# Altium schematic sheet ESP8285.SchDoc
size A; SheetNumber: 1
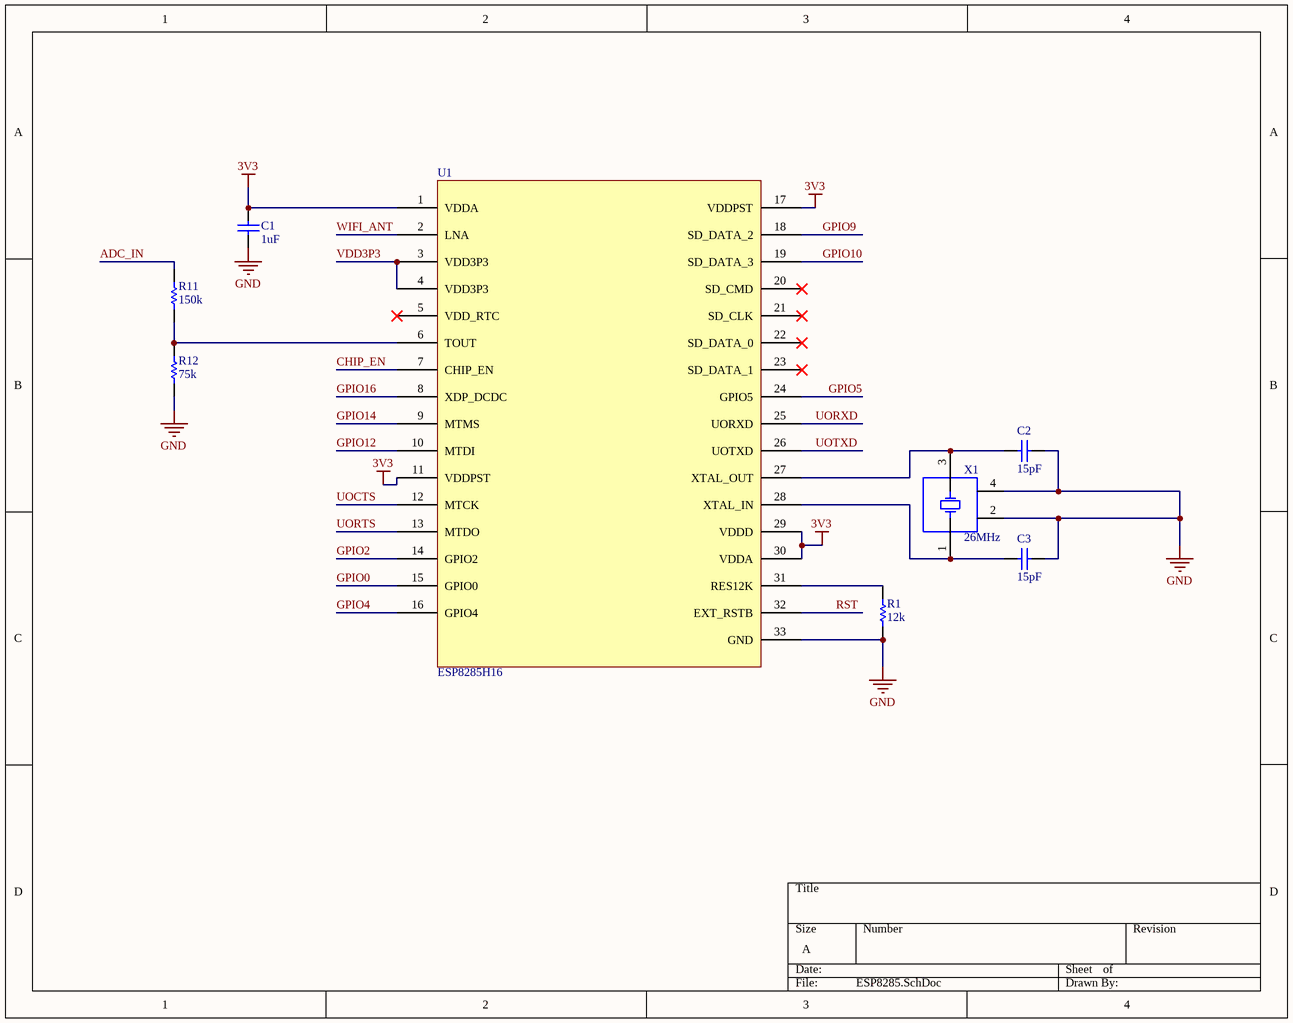
[diagram p0: ESP8285.SchDoc]

## Parts
C1  1uF  [C0805]
C2  15pF  [PCB-98fz84kwkqgd8opjlb99-1]
C3  15pF  [PCB-98fz84kwkqgd8opjlb99-1]
R1  12k  [RESC1609X50X30LL10T20]
R11  150k  [RESC1608X55X30LL15T15]
R12  75k  [RESC1608X55X30LL15T15]
U1  ESP8285H16  [PCB-1fh2hqe1x48mh17li7t6-1]
X1  26MHz  [PCB-1zhjv6m1p58g6yr6i7sc-1]

## Nets
3V3: C1.1 U1.1(VDDA) U1.11(VDDPST) U1.17(VDDPST) U1.29(VDDD) U1.30(VDDA)
GND: C1.2 C2.2 C3.2 R1.1 R12.1 U1.33(GND) X1.2 X1.4
ADC_IN: R11.2
CHIP_EN: U1.7(CHIP_EN)
GPIO0: U1.15(GPIO0)
GPIO2: U1.14(GPIO2)
GPIO4: U1.16(GPIO4)
GPIO5: U1.24(GPIO5)
GPIO9: U1.18(SD_DATA_2)
GPIO10: U1.19(SD_DATA_3)
GPIO12: U1.10(MTDI)
GPIO14: U1.9(MTMS)
GPIO16: U1.8(XDP_DCDC)
RST: U1.32(EXT_RSTB)
UOCTS: U1.12(MTCK)
UORTS: U1.13(MTDO)
UORXD: U1.25(UORXD)
UOTXD: U1.26(UOTXD)
VDD3P3: U1.3(VDD3P3) U1.4(VDD3P3)
WIFI_ANT: U1.2(LNA)
NetC2_1: C2.1 U1.27(XTAL_OUT) X1.3
NetC3_1: C3.1 U1.28(XTAL_IN) X1.1
NetR1_2: R1.2 U1.31(RES12K)
NetR11_1: R11.1 R12.2 U1.6(TOUT)

Not connected (* = marked no-connect by the designer): U1 5(VDD_RTC)* 20(SD_CMD)* 21(SD_CLK)* 22(SD_DATA_0)* 23(SD_DATA_1)*

## Library data of the parts
C1 = CMP-77c3bc4dc880a804-3: 0805 1 uF 25 V ±10 % Tolerance X7R SMT Multilayer Ceramic Capacitor; Manufacturer Part Number: CC0805KKX7R8BB105; Lead-Free Status: Lead Free; Voltage Rating (DC): 25.0 V; Capacitance Tolerance: ±10%; Octopart Url: http://octopart.com/cc0805kkx7r8bb105-yageo-42244645; Seller Landing  Url: https://octopart-clicks.com/click/track?country=US&ak=8157f166&sig=04b9cde&sid=5489&ppid=42244645&vpid=127579773&ct=offers; Number of Pins: 2; Mounting Style: Surface Mount; Packaging: Cut Tape (CT); Case/Package: 0805; REACH SVHC Compliance: No SVHC; RoHS: Compliant; Halogen Free Status: Halogen Free; Capacitance: 1uF; OctopartID: 77c3bc4dc880a804; Dielectric Characteristic: X7R
C2 C3 = CMP-a0ab688c22207f6c-1: 15pF ±1% 50V C0G, NP0 Ceramic Capacitor -55°C ~ 125°C Surface Mount, MLCC 0402 (1005 Metric) 0.039" L x 0.020" W (1.00mm x 0.50mm); Manufacturer Part Number: GRM1555C1H150FA01D; Manufacturer: Murata Electronics North America; Vendor Part Number: 490-6200-1-ND; Manufacturer Part Number, Other: 490-6200-1; Category: Capacitors; Family: Digikey; Capacitance: 15pF; Cost: Ceramic Capacitors; Tolerance: ±1%; Thickness (Max): 0.022" (0.55mm); Octopart URL: http://octopart.com/grm1555c1h150fa01d-murata-19769325; OctopartID: a0ab688c22207f6c; Operating Temperature: -55°C ~ 125°C; Size / Dimension: 0.039" L x 0.020" W (1.00mm x 0.50mm); Temperature Coefficien: C0G, NP0; Mounting Type: Surface Mount, MLCC; Applications: General Purpose; Package / Case: 0402 (1005 Metric); Voltage - Rated: 50V
R1 = CMP-1857522-10: Res Thick Film 0603 12K Ohm 1% 0.1W(1/10W) ±100ppm/C Molded SMD Automotive Paper T/R
R11 = CMP-3654711-2: Thick Film Resistors - SMD 0603 150Kohms 1% Tol; Manufacturer Part Number: ERJ-3EKF1503V; Lead-Free Status: Lead Free; Power Rating: 0.1 W; Resistance: 150000.0 Ω; Voltage Rating (DC): 75.0 V; Case/Package: 0603; Lifecycle Status: Not Listed by Manufacturer; Mounting Style: Surface Mount; Number of Pins: 2; Octopart Url: https://octopart.com/erj-3ekf1503v-panasonic-55421489; OctopartID: de4c140b511b018b; REACH SVHC Compliance: No SVHC; Resistance Tolerance: ±1%; RoHS: Compliant; Size-Height: 0.00045 m; Size-Length: 0.0016 m; Size-Width: 0.0008 m
R12 = CMP-3654871-2: Thick Film Resistors - SMD 0603 75Kohms 1% Tol; Manufacturer Part Number: ERJ-3EKF7502V; Lead-Free Status: Lead Free; Power Rating: 0.1 W; Resistance: 75000.0 Ω; Voltage Rating (DC): 75.0 V; Case/Package: 0603; Lifecycle Status: Not Listed by Manufacturer; Mounting Style: Surface Mount; Octopart Url: https://octopart.com/erj-3ekf7502v-panasonic-55421908; OctopartID: 327df83abccfedba; Packaging: Cut Tape (CT); REACH SVHC Compliance: No SVHC; Resistance Tolerance: ±1%; RoHS: Compliant; Size-Height: 0.00045 m; Size-Length: 0.0016 m; Size-Width: 0.0008 m
U1 = CMP-265ae9019d32f99d-2: RF Transceiver 64QAM/BPSK/CCK/DSSS/OFDM 2.7V to 3.6V 2400MHz to 2483.5MHz 32-Pin QFN; Manufacturer Part Number: ESP8285H16; OctopartID: 265ae9019d32f99d; Octopart URL: https://octopart.com/esp8285h16-espressif+systems-106012174
X1 = CMP-932d5a23796e4cea-3: Crystal 26MHz ±10ppm (Tol) ±10ppm (Stability) 10pF FUND 50Ohm 4-Pin CSMD T/R; Manufacturer Part Number: ABM8-26.000MHZ-10-1-U-T; Frequency: 26.0 MHz; Packaging: Cut Tape (CT); Size-Length: 3.20 mm